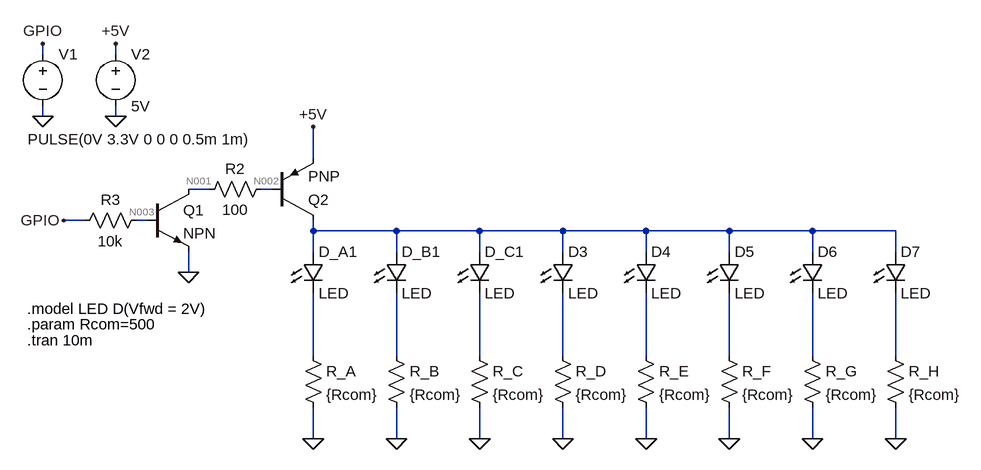
[diagram p0: schematic display_control_pnp.asc]
display_control_pnp.asc, the LTspice schematic file:
Version 4
SHEET 1 1380 680
WIRE -48 -80 -48 -96
WIRE 64 -80 64 -96
WIRE -48 16 -48 0
WIRE 64 16 64 0
WIRE 368 80 368 32
WIRE 208 128 176 128
WIRE 304 128 288 128
WIRE 16 176 -16 176
WIRE 112 176 96 176
WIRE 368 192 368 176
WIRE 496 192 368 192
WIRE 624 192 496 192
WIRE 752 192 624 192
WIRE 880 192 752 192
WIRE 1008 192 880 192
WIRE 1136 192 1008 192
WIRE 1264 192 1136 192
WIRE 368 224 368 192
WIRE 496 224 496 192
WIRE 624 224 624 192
WIRE 752 224 752 192
WIRE 880 224 880 192
WIRE 1008 224 1008 192
WIRE 1136 224 1136 192
WIRE 1264 224 1264 192
WIRE 176 256 176 224
WIRE 368 384 368 288
WIRE 496 384 496 288
WIRE 624 384 624 288
WIRE 752 384 752 288
WIRE 880 384 880 288
WIRE 1008 384 1008 288
WIRE 1136 384 1136 288
WIRE 1264 384 1264 288
WIRE 368 512 368 464
WIRE 496 512 496 464
WIRE 624 512 624 464
WIRE 752 512 752 464
WIRE 880 512 880 464
WIRE 1008 512 1008 464
WIRE 1136 512 1136 464
WIRE 1264 512 1264 464
FLAG 368 512 0
FLAG 368 32 +5V
FLAG -16 176 GPIO
FLAG -48 16 0
FLAG 64 16 0
FLAG -48 -96 GPIO
FLAG 64 -96 +5V
FLAG 752 512 0
FLAG 880 512 0
FLAG 1008 512 0
FLAG 1136 512 0
FLAG 1264 512 0
FLAG 496 512 0
FLAG 624 512 0
FLAG 176 256 0
SYMBOL npn 112 128 R0
SYMATTR InstName Q1
SYMBOL res 352 368 R0
SYMATTR InstName R_A
SYMATTR Value {Rcom}
SYMBOL res 304 112 R90
WINDOW 0 0 56 VBottom 2
WINDOW 3 32 56 VTop 2
SYMATTR InstName R2
SYMATTR Value 100
SYMBOL res 112 160 R90
WINDOW 0 0 56 VBottom 2
WINDOW 3 32 56 VTop 2
SYMATTR InstName R3
SYMATTR Value 10k
SYMBOL voltage -48 -96 R0
WINDOW 3 -23 147 Left 2
WINDOW 123 0 0 Left 0
WINDOW 39 0 0 Left 0
SYMATTR Value PULSE(0V 3.3V 0 0 0 0.5m 1m)
SYMATTR InstName V1
SYMBOL voltage 64 -96 R0
WINDOW 123 0 0 Left 0
WINDOW 39 0 0 Left 0
SYMATTR InstName V2
SYMATTR Value 5V
SYMBOL LED 352 224 R0
SYMATTR InstName D_A1
SYMATTR Value LED
SYMBOL pnp 304 176 M180
SYMATTR InstName Q2
SYMBOL LED 480 224 R0
SYMATTR InstName D_B1
SYMATTR Value LED
SYMBOL LED 608 224 R0
SYMATTR InstName D_C1
SYMATTR Value LED
SYMBOL LED 736 224 R0
SYMATTR InstName D3
SYMATTR Value LED
SYMBOL LED 864 224 R0
SYMATTR InstName D4
SYMATTR Value LED
SYMBOL LED 992 224 R0
SYMATTR InstName D5
SYMATTR Value LED
SYMBOL LED 1120 224 R0
SYMATTR InstName D6
SYMATTR Value LED
SYMBOL LED 1248 224 R0
SYMATTR InstName D7
SYMATTR Value LED
SYMBOL res 480 368 R0
SYMATTR InstName R_B
SYMATTR Value {Rcom}
SYMBOL res 608 368 R0
SYMATTR InstName R_C
SYMATTR Value {Rcom}
SYMBOL res 736 368 R0
SYMATTR InstName R_D
SYMATTR Value {Rcom}
SYMBOL res 864 368 R0
SYMATTR InstName R_E
SYMATTR Value {Rcom}
SYMBOL res 992 368 R0
SYMATTR InstName R_F
SYMATTR Value {Rcom}
SYMBOL res 1120 368 R0
SYMATTR InstName R_G
SYMATTR Value {Rcom}
SYMBOL res 1248 368 R0
SYMATTR InstName R_H
SYMATTR Value {Rcom}
TEXT -72 360 Left 2 !.tran 10m
TEXT -72 312 Left 2 !.model LED D(Vfwd = 2V)
TEXT -72 336 Left 2 !.param Rcom=500

The netlist it stands for:
* display_control_pnp.asc
Q1 N001 N003 0 0 NPN
R_A N005 0 {Rcom}
R2 N002 N001 100
R3 N003 GPIO 10k
V1 GPIO 0 PULSE(0V 3.3V 0 0 0 0.5m 1m)
V2 +5V 0 5V
D_A1 N004 N005 LED
Q2 N004 N002 +5V 0 PNP
D_B1 N004 N006 LED
D_C1 N004 N007 LED
D3 N004 N008 LED
D4 N004 N009 LED
D5 N004 N010 LED
D6 N004 N011 LED
D7 N004 N012 LED
R_B N006 0 {Rcom}
R_C N007 0 {Rcom}
R_D N008 0 {Rcom}
R_E N009 0 {Rcom}
R_F N010 0 {Rcom}
R_G N011 0 {Rcom}
R_H N012 0 {Rcom}
.model D D
.lib standard.dio
.model NPN NPN
.model PNP PNP
.lib standard.bjt
.tran 10m
.model LED D(Vfwd = 2V)
.param Rcom=500
.backanno
.end

* Results of the author's LTspice run, read from the files saved beside the schematic
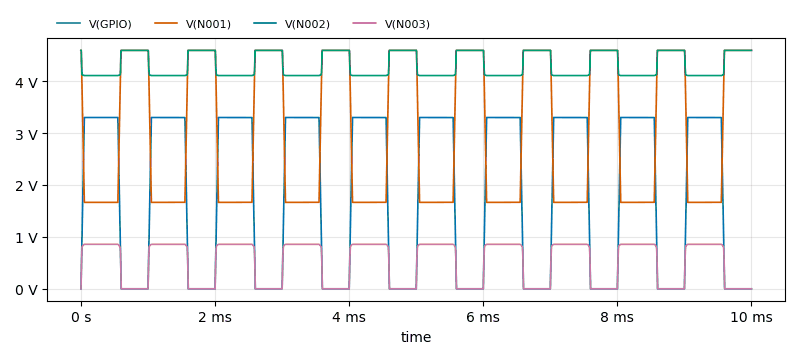
[diagram p1: Transient Analysis of display_control_pnp.asc, plotted from the saved traces]
* Transient Analysis, 1 run:
*   V(GPIO): min 0 V, max 3.3 V, average 1.815 V, rms 2.411 V, last 0 V
*   V(N001): min 1.665 V, max 4.593 V, average 2.997 V, rms 3.314 V, last 4.593 V
*   V(N002): min 4.108 V, max 4.593 V, average 4.311 V, rms 4.318 V, last 4.593 V
*   V(N003): min 0 V, max 857 mV, average 500.2 mV, rms 650.8 mV, last 0 V